# EAGLE design rs232 (EAGLE 4.16)
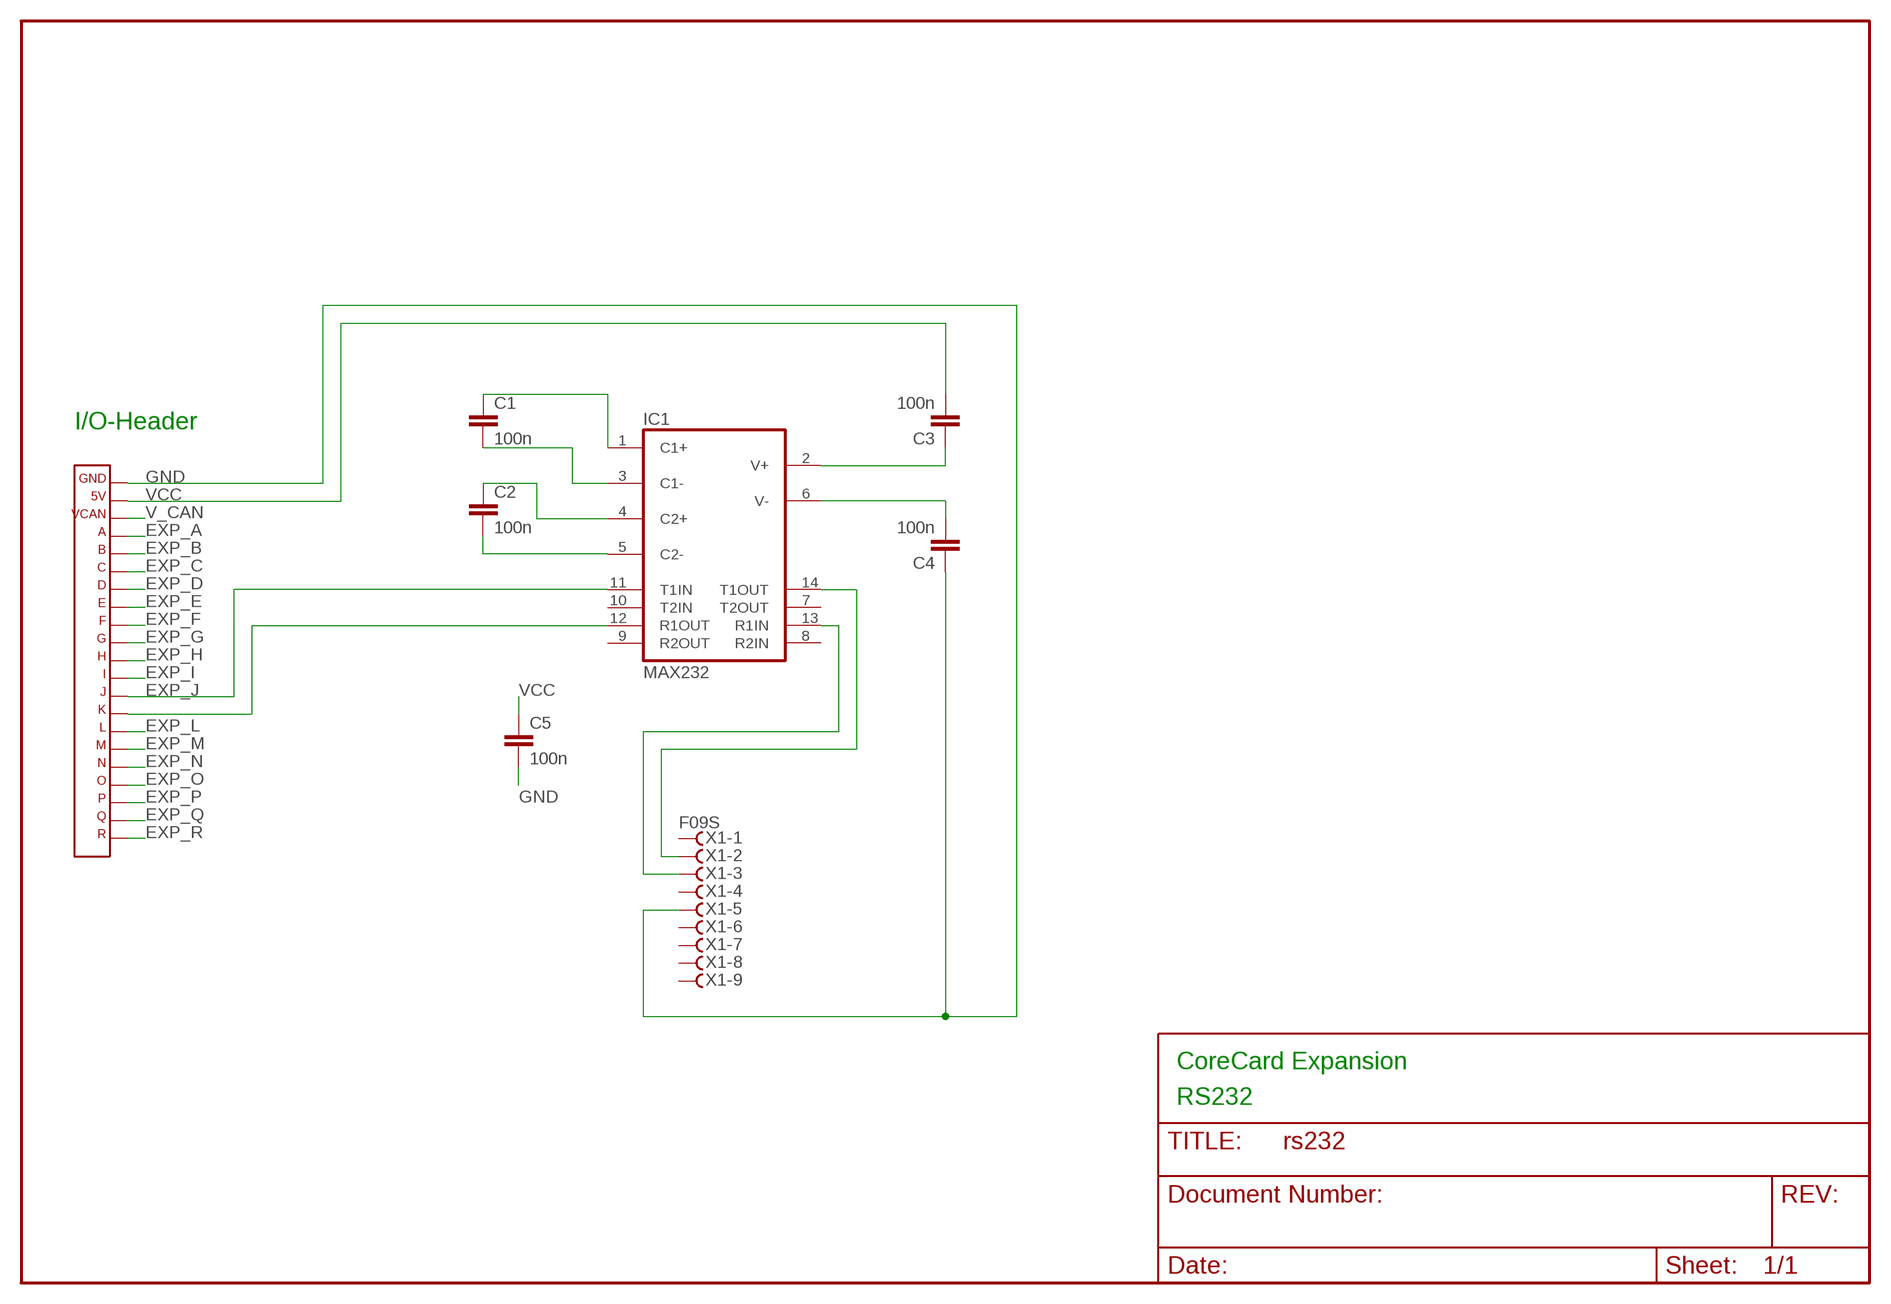
[diagram p0: schematic, sheet 1]

## Parts
C1  100n  C2.5/4  [C2.5-4]
C2  100n  C2.5/4  [C2.5-4]
C3  100n  C2.5/4  [C2.5-4]
C4  100n  C2.5/4  [C2.5-4]
C5  100n  C2.5/4  [C2.5-4]
IC1  MAX232  [DIL16]
X1  F09S  F09HS  [F09H]
X3  CORE_IOHEADEXP  [CORE_IOHEAD_NOSILC]

## Nets
EXP_A: X3.4
EXP_B: X3.5
EXP_C: X3.6
EXP_D: X3.7
EXP_E: X3.8
EXP_F: X3.9
EXP_G: X3.10
EXP_H: X3.11
EXP_I: X3.12
EXP_J: IC1.11(T1IN) X3.13
EXP_L: X3.15
EXP_M: X3.16
EXP_N: X3.17
EXP_O: X3.18
EXP_P: X3.19
EXP_Q: X3.20
EXP_R: X3.21
GND: C4.1 C5.2 X1.5 X3.1
N$1: C1.1 IC1.1(C1+)
N$2: C1.2 IC1.3(C1-)
N$3: C2.1 IC1.4(C2+)
N$4: C2.2 IC1.5(C2-)
N$8: IC1.12(R1OUT) X3.14
R1IN: IC1.13(R1IN) X1.3
T1OUT: IC1.14(T1OUT) X1.2
V+: C3.1 IC1.2(V+)
V-: C4.2 IC1.6(V-)
V_CAN: X3.3
VCC: C3.2 C5.1 X3.2
Unconnected: IC1.7(T2OUT) IC1.8(R2IN) IC1.9(R2OUT) IC1.10(T2IN) X1.1 X1.4 X1.6 X1.7 X1.8 X1.9

## Notes on the sheet
- I/O-Header
- CoreCard Expansion
- RS232

## Power pins joined to a net without a drawn wire
GND: IC1.15(GND)
VCC: IC1.16(VCC)

## Library data of the parts
C1-C5 = capacitor-wima:C: CAPACITOR naming: grid - package width
IC1 = maxim:MAX232: RS232 TRANSEIVER
X1 = dsub:F09?S
X3 = expboard:CORE_IOHEAD: CoreCard IO-header for expansion cards

## Board
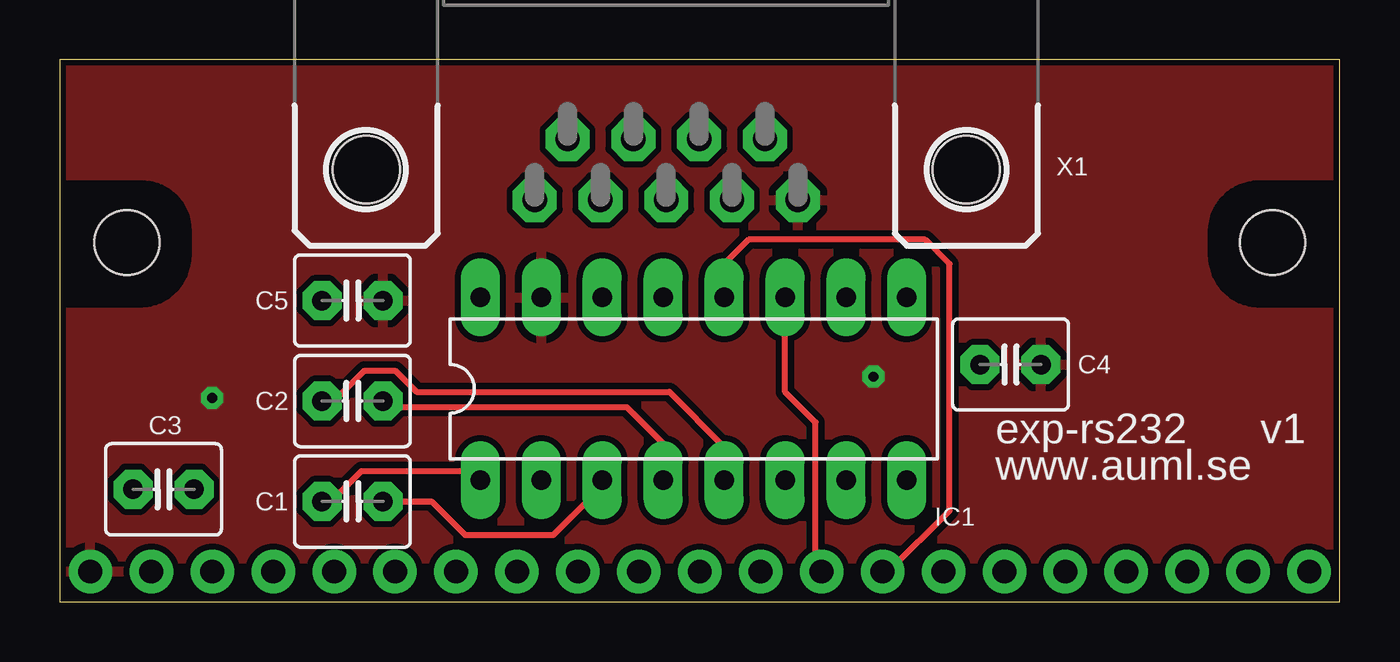
[diagram p1: board, top side]
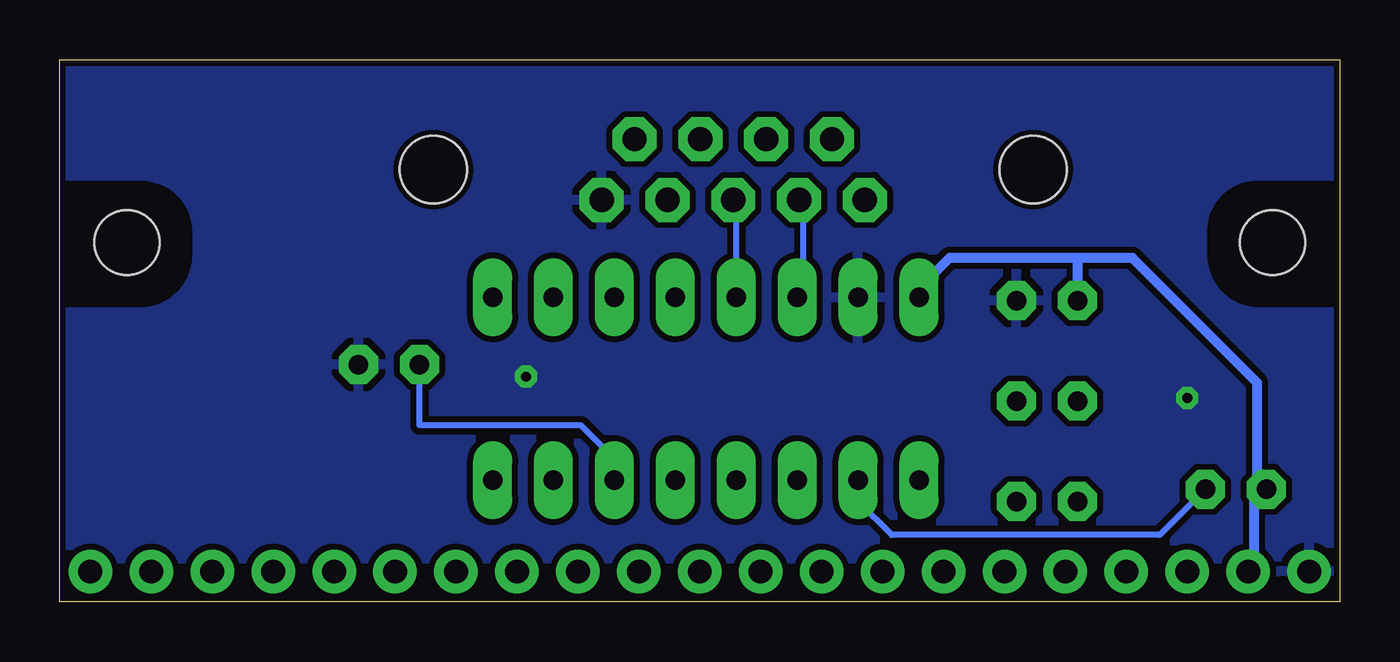
[diagram p2: board, bottom side, seen from below]

Size 53.34 x 22.61 mm. Coordinates in mm from the lower left corner, seen from the top.
Outline: 0,0 53.34,0 53.34,22.61 0,22.61 0,0
Copper layers (1*16): Top 0.035mm / dielectric 1.5mm / Bottom 0.035mm
Design rules "default": minimum track width 10mil, minimum drill 0.4mm, track to track 10mil, track to pad 10mil, pad to pad 10mil, via to via 10mil, smd to smd 10mil, copper to edge 10mil, drill to drill 8mil, minimum pad ring 16mil, minimum via ring 10mil, stop-mask expansion 4mil, vias tented up to drill 18mil, thermal gap 12mil
Holes 2.7 mm at 50.55,14.99 2.79,14.99

### Footprints (pad centres in the part's own frame; a part is rotated, then mirrored left to right if it is on the bottom)
C2.5-4 = drill 0.813 pad 1.6 octagon: 1 -1.27,0; 2 1.27,0
DIL16 = drill 0.813 long: 1 -8.89,-3.81; 2 -6.35,-3.81; 3 -3.81,-3.81; 4 -1.27,-3.81; 5 1.27,-3.81; 6 3.81,-3.81; 7 6.35,-3.81; 8 8.89,-3.81; 9 8.89,3.81; 10 6.35,3.81; 11 3.81,3.81; 12 1.27,3.81; 13 -1.27,3.81; 14 -3.81,3.81; 15 -6.35,3.81; 16 -8.89,3.81
F09H = drill 1.016 octagon: 1 -5.486,-1.27; 2 -2.743,-1.27; 3 0,-1.27; 4 2.743,-1.27; 5 5.486,-1.27; 6 -4.115,1.27; 7 -1.372,1.27; 8 1.372,1.27; 9 4.115,1.27 | hole 2.8: -12.5,0; 12.5,0
CORE_IOHEAD_NOSILC = drill 1 round: 1 25.4,0; 2 22.86,0; 3 20.32,0; 4 17.78,0; 5 15.24,0; 6 12.7,0; 7 10.16,0; 8 7.62,0; 9 5.08,0; 10 2.54,0; 11 0,0; 12 -2.54,0; 13 -5.08,0; 14 -7.62,0; 15 -10.16,0; 16 -12.7,0; 17 -15.24,0; 18 -17.78,0; 19 -20.32,0; 20 -22.86,0; 21 -25.4,0

### Placement (x,y rotation side)
C1  12.19,4.19 0 top
C2  12.19,8.38 180 top
C3  4.32,4.7 180 top
C4  39.62,9.91 180 top
C5  12.19,12.57 0 top
IC1  26.42,8.89 0 top
X1  25.27,18.03 0 top
X3  26.67,1.27 0 bottom

### Tracks (layer width: path | path; a pad name or v marks a point on that pad's centre or on a via)
EXP_J
  Top 0.254: X3.13 31.5,1.52 31.5,7.49 30.23,8.76 IC1.11
GND  (via drill 0.41)
  other vias: 6.35,8.51 33.91,9.4
  pour Bottom (rank 3): 0,22.61 53.34,22.61 53.34,17.78 50.04,17.78 arc90 47.62,15.49 47.62,14.48 arc90 50.04,12.06 53.34,12.06 53.34,1.14 0,1.14 0,12.06 3.3,12.06 arc90 5.71,14.48 5.71,15.49 arc90 3.43,17.78 0,17.78
  pour Top (rank 3): 0,22.61 53.34,22.61 53.34,17.78 50.04,17.78 arc90 47.62,15.49 47.62,14.48 arc90 50.04,12.06 53.34,12.06 53.34,1.14 0,1.14 0,12.06 3.3,12.06 arc90 5.71,14.48 5.71,15.49 arc90 3.43,17.78 0,17.78
N$1
  Top 0.254: IC1.1 17.14,5.46 12.57,5.46 11.3,4.19 C1.1
N$2
  Top 0.254: IC1.3 22.61,4.83 20.57,2.79 16.89,2.79 15.49,4.19 C1.2
N$3
  Top 0.254: IC1.4 25.15,6.6 23.62,8.13 13.72,8.13 C2.1
N$4
  Top 0.254: IC1.5 27.69,6.48 25.4,8.76 14.86,8.76 13.97,9.65 12.7,9.65 11.43,8.38 C2.2
N$8
  Top 0.254: X3.14 34.54,1.27 37.08,3.81 37.08,14.1 36.07,15.11 28.7,15.11 27.69,14.1 IC1.12
R1IN
  Bottom 0.254: IC1.13 25.15,16.64 X1.3
T1OUT
  Bottom 0.254: IC1.14 22.35,12.95 22.35,16.76 X1.2
V+
  Bottom 0.254: IC1.2 20.07,4.19 18.67,2.79 7.49,2.79 C3.1
V-
  Bottom 0.254: 30.23,4.95 IC1.6 30.23,5.97 31.62,7.37 38.35,7.37 C4.2
VCC
  Bottom 0.406: IC1.16 17.53,12.83 17.65,12.95 16.26,14.35 10.92,14.35 | 10.92,14.35 8.64,14.35 3.43,9.14 3.43,5.08 C3.2 3.56,4.19 3.56,1.52 X3.2 | 10.92,14.35 C5.1

### Text on the board
tPlace: exp-rs232 | v1 | www.auml.se
Document: Top is component side | Expansion will be mounted bottom to bottom with CoreCard | Change vertical dimension to fit | Remove I/O-header silcscreen if neccesary | Remove mounting holes if neccesary